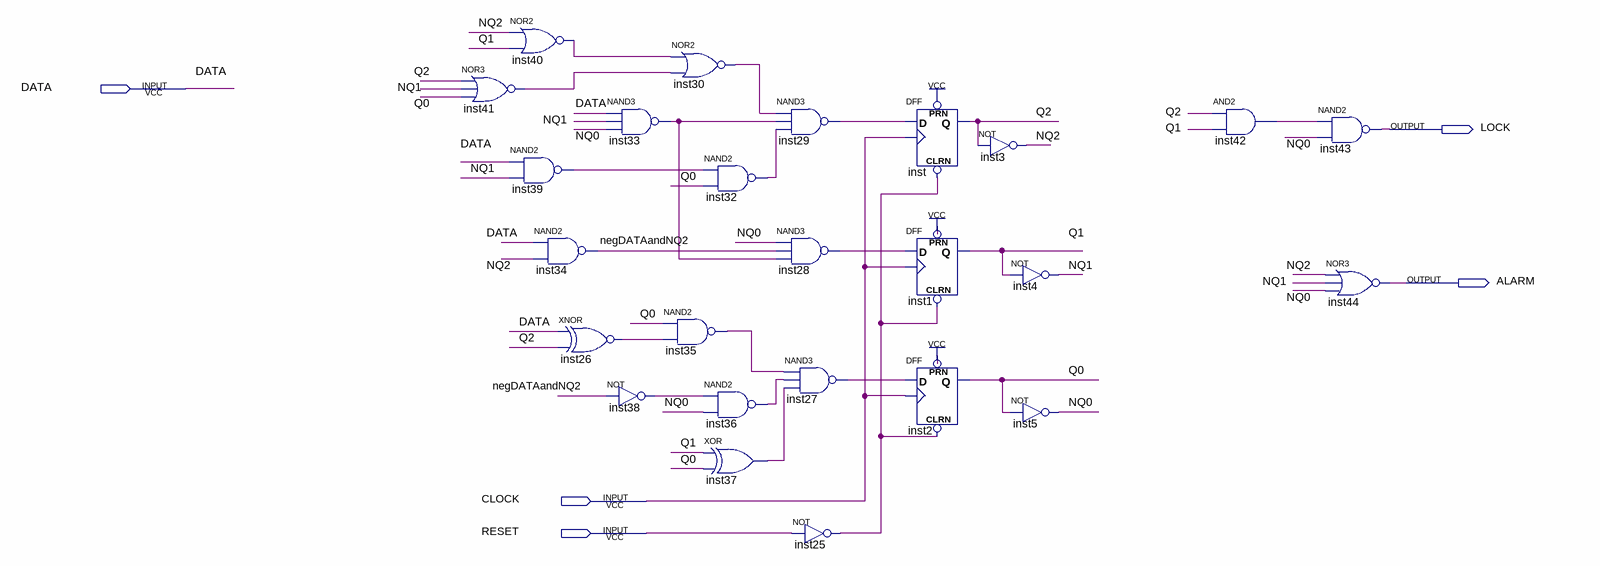
[diagram p0: schematic sheet]
// Quartus schematic dlock.bdf as structural Verilog: 25 symbols, 5 pins
module dlock (
  input  DATA,
  input  CLOCK,
  input  RESET,
  output LOCK,
  output ALARM
);

  wire inst25_out, inst26_out, inst27_out, inst28_out, inst29_out, inst30_out, inst32_out, inst33_out,
       inst35_out, inst36_out, inst37_out, inst38_out, inst39_out, inst40_out, inst41_out, inst42_out,
       negDATAandNQ2, NQ0, NQ1, NQ2, Q0, Q1, Q2;

  nor inst40 (inst40_out, NQ2, Q1);
  nor inst41 (inst41_out, Q2, NQ1, Q0);
  nand inst39 (inst39_out, DATA, NQ1);
  nand inst34 (negDATAandNQ2, DATA, NQ2);
  xnor inst26 (inst26_out, DATA, Q2);
  nand inst33 (inst33_out, DATA, NQ1, NQ0);
  not inst38 (inst38_out, negDATAandNQ2);
  nor inst30 (inst30_out, inst40_out, inst41_out);
  nand inst32 (inst32_out, inst39_out, Q0);
  nand inst35 (inst35_out, Q0, inst26_out);
  nand inst36 (inst36_out, inst38_out, NQ0);
  xor inst37 (inst37_out, Q1, Q0);
  nand inst29 (inst29_out, inst30_out, inst33_out, inst32_out);
  nand inst28 (inst28_out, NQ0, negDATAandNQ2, inst33_out);
  nand inst27 (inst27_out, inst35_out, inst36_out, inst37_out);
  not inst25 (inst25_out, RESET);
  DFF inst (.CLRN(inst25_out), .CLK(CLOCK), .D(inst29_out), .PRN(1'b1), .Q(Q2));
  DFF inst1 (.CLRN(inst25_out), .CLK(CLOCK), .D(inst28_out), .PRN(1'b1), .Q(Q1));
  DFF inst2 (.CLRN(inst25_out), .CLK(CLOCK), .D(inst27_out), .PRN(1'b1), .Q(Q0));
  not inst3 (NQ2, Q2);
  not inst4 (NQ1, Q1);
  not inst5 (NQ0, Q0);
  and inst42 (inst42_out, Q2, Q1);
  nand inst43 (LOCK, inst42_out, NQ0);
  nor inst44 (ALARM, NQ2, NQ1, NQ0);
endmodule
